# EAGLE design MODUL_GNU-BO_BRIDGE_V101 (EAGLE 6.4)
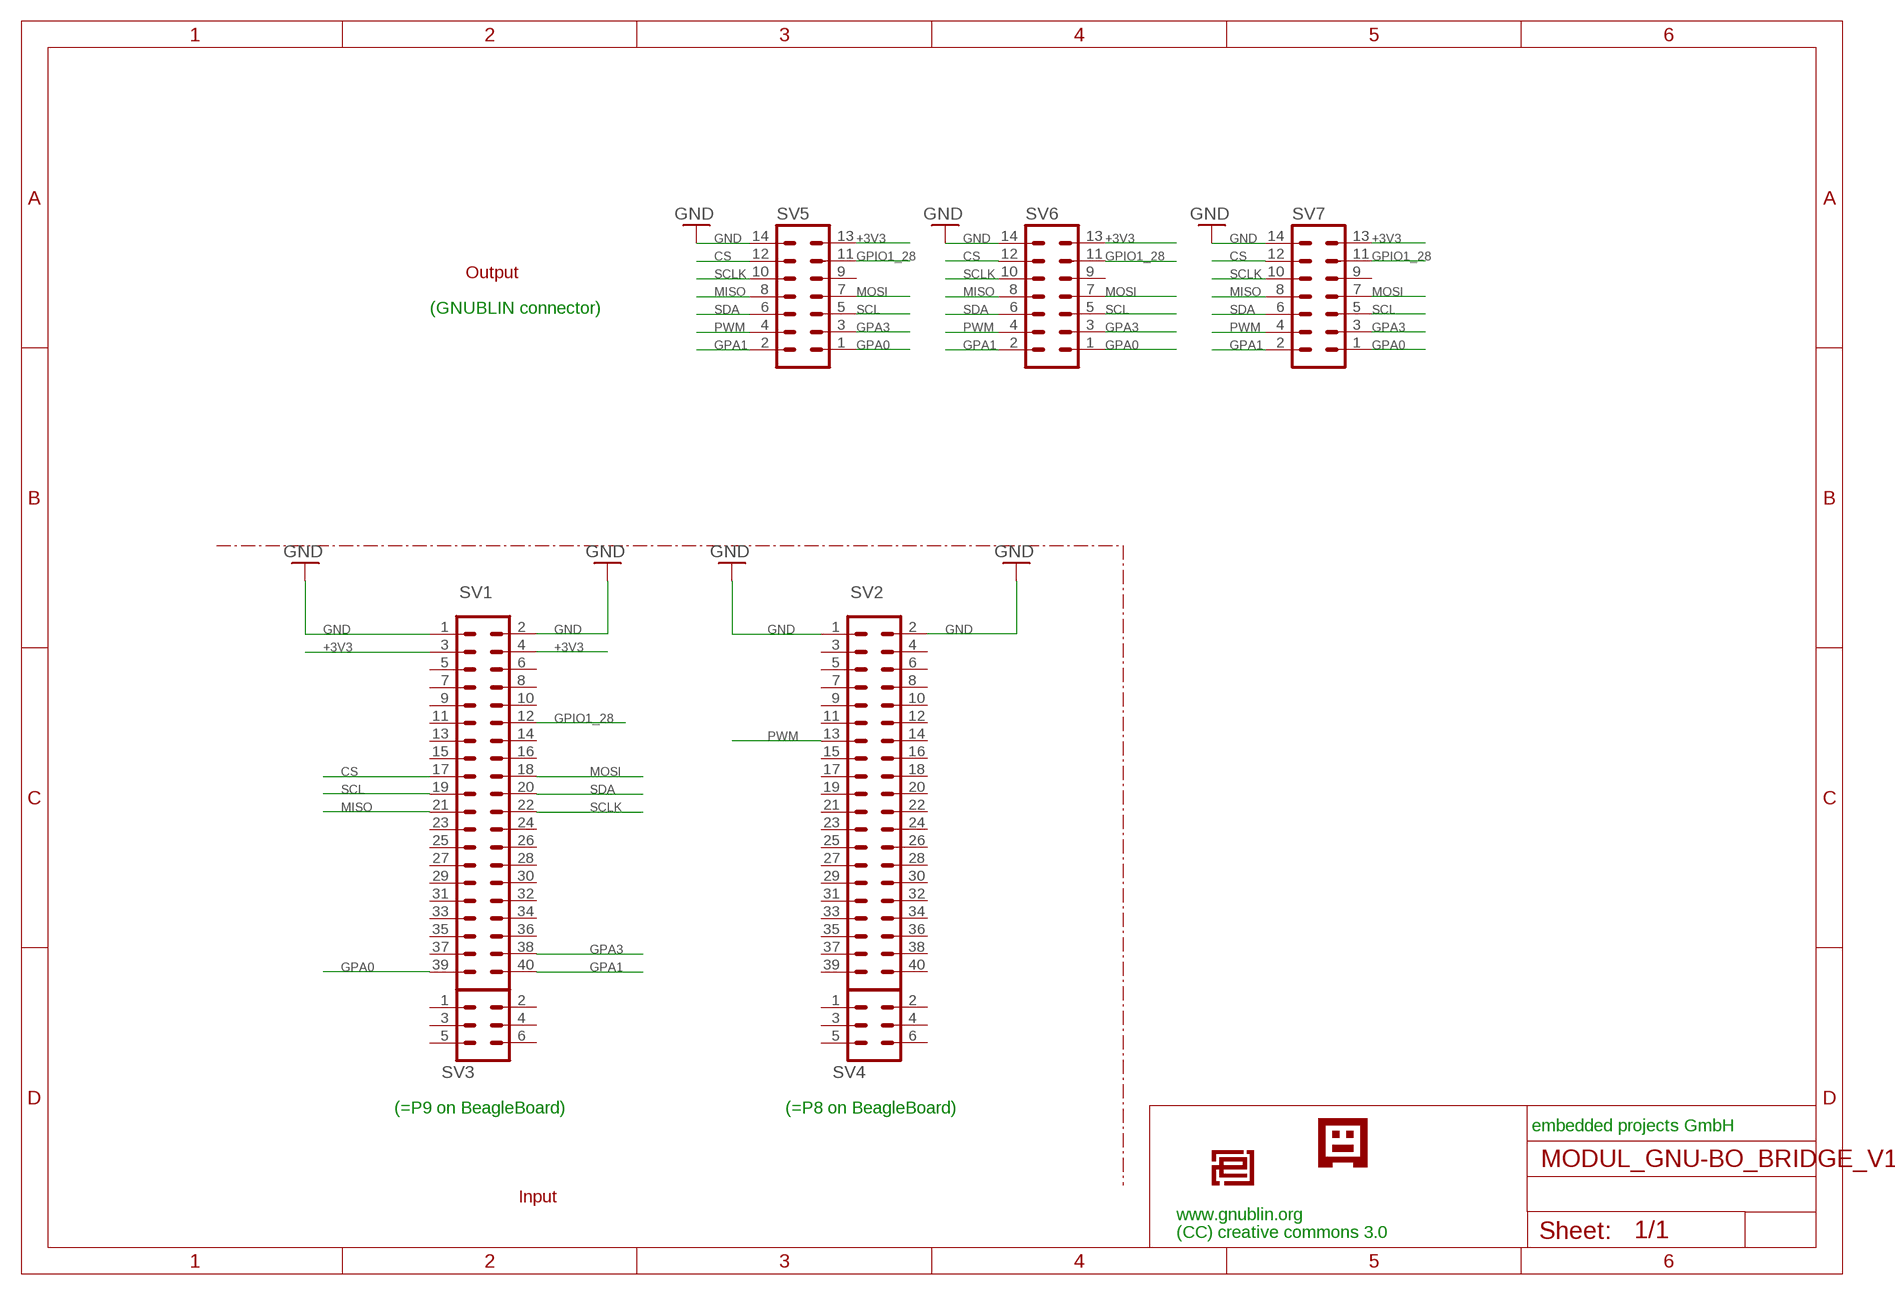
[diagram p0: schematic, sheet 1]

## Parts
SV1  MA20-2  [MA20-2]
SV2  MA20-2  [MA20-2]
SV3  MA03-2  [MA03-2]
SV4  MA03-2  [MA03-2]
SV5  ML14  [ML14]
SV6  ML14  [ML14]
SV7  ML14  [ML14]
U$2  EPLOGOSIEB  [EPLOGOSIEBDRUCK]
U$3  GNUBLINLOGOSIEB  [GNUSIEBDRUCK]

## Nets
+3V3: SV1.3 SV1.4 SV5.13 SV6.13 SV7.13
CS: SV1.17 SV5.12 SV6.12 SV7.12
GND: SV1.1 SV1.2 SV2.1 SV2.2 SV5.14 SV6.14 SV7.14
GPA0: SV1.39 SV5.1 SV6.1 SV7.1
GPA1: SV1.40 SV5.2 SV6.2 SV7.2
GPA3: SV1.38 SV5.3 SV6.3 SV7.3
GPIO1_28: SV1.12 SV5.11 SV6.11 SV7.11
MISO: SV1.21 SV5.8 SV6.8 SV7.8
MOSI: SV1.18 SV5.7 SV6.7 SV7.7
PWM: SV2.13 SV5.4 SV6.4 SV7.4
SCL: SV1.19 SV5.5 SV6.5 SV7.5
SCLK: SV1.22 SV5.10 SV6.10 SV7.10
SDA: SV1.20 SV5.6 SV6.6 SV7.6
Unconnected: SV1.5 SV1.6 SV1.7 SV1.8 SV1.9 SV1.10 SV1.11 SV1.13 SV1.14 SV1.15 SV1.16 SV1.23 SV1.24 SV1.25 SV1.26 SV1.27 SV1.28 SV1.29 SV1.30 SV1.31 SV1.32 SV1.33 SV1.34 SV1.35 SV1.36 SV1.37 SV2.3 SV2.4 SV2.5 SV2.6 SV2.7 SV2.8 SV2.9 SV2.10 SV2.11 SV2.12 SV2.14 SV2.15 SV2.16 SV2.17 SV2.18 SV2.19 SV2.20 SV2.21 SV2.22 SV2.23 SV2.24 SV2.25 SV2.26 SV2.27 SV2.28 SV2.29 SV2.30 SV2.31 SV2.32 SV2.33 SV2.34 SV2.35 SV2.36 SV2.37 SV2.38 SV2.39 SV2.40 SV3.1 SV3.2 SV3.3 SV3.4 SV3.5 SV3.6 SV4.1 SV4.2 SV4.3 SV4.4 SV4.5 SV4.6 SV5.9 SV6.9 SV7.9

## Notes on the sheet
- Output
- (GNUBLIN connector)
- (=P9 on BeagleBoard) | (=P8 on BeagleBoard)
- embedded projects GmbH
- Input
- www.gnublin.org
- (CC) creative commons 3.0

## Library data of the parts
SV1 SV2 = con-lstb:MA20-2: PIN HEADER
SV3 SV4 = con-lstb:MA03-2: PIN HEADER
SV5-SV7 = con-ml:ML14: HARTING
U$2 = EmbeddedProjectsLogos2:EPLOGO
U$3 = EmbeddedProjectsLogos2:GNUBLINLOGO

## Board
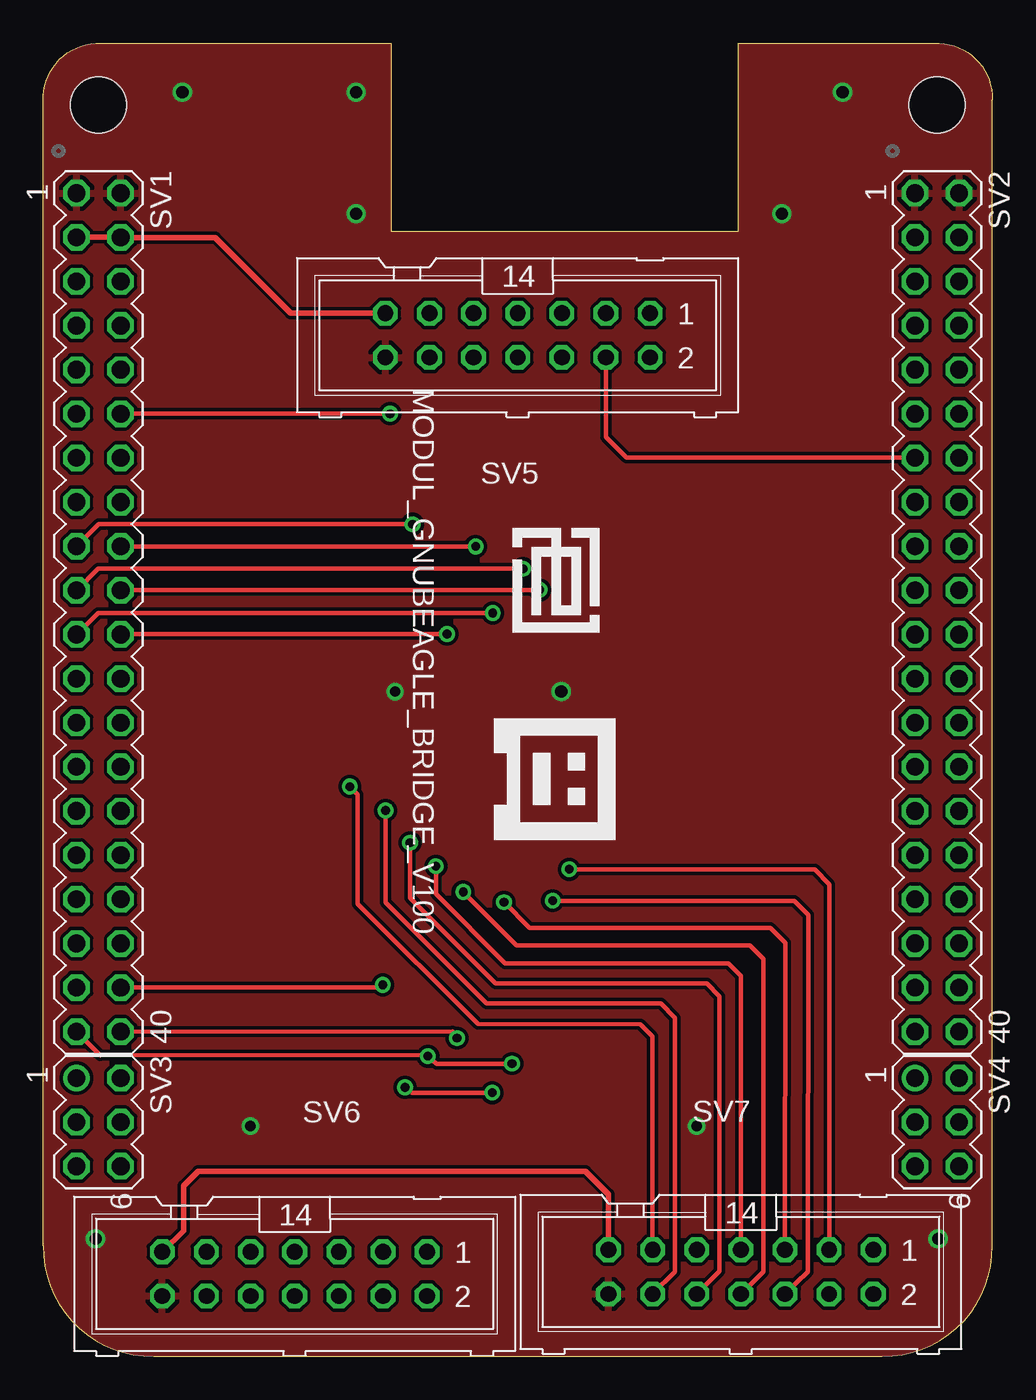
[diagram p1: board, top side]
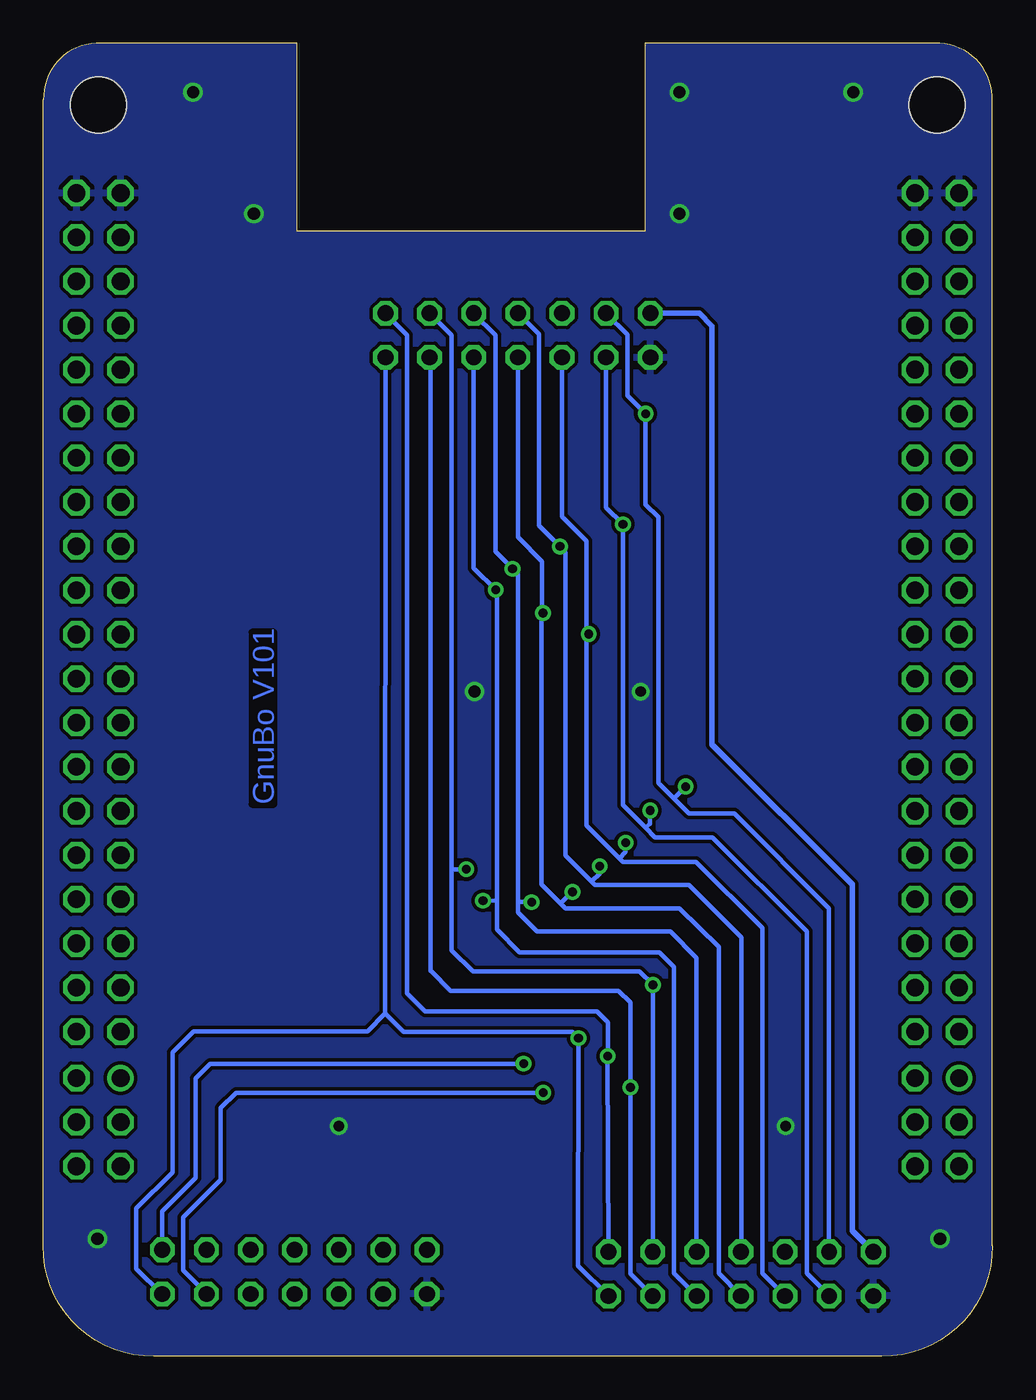
[diagram p2: board, bottom side, seen from below]

Size 54.61 x 75.55 mm. Coordinates in mm from the lower left corner, seen from the top.
Outline: 0,6.35 0,72.54 arc-90 3.3,75.55 20,75.55 20,64.75 40,64.75 40,75.55 51.56,75.55 arc-90 54.61,72.32 54.61,6.35 arc-92 48.26,0 6.35,0 arc-92 0,6.35
Copper layers (1*16): Top 0.035mm / dielectric 1.5mm / Bottom 0.035mm
Design rules "default *": minimum track width 8mil, minimum drill 15mil, track to track 8mil, track to pad 8mil, pad to pad 8mil, via to via 8mil, smd to smd 8mil, copper to edge 1mil, drill to drill 8mil, minimum pad ring 10mil, minimum via ring 8mil, stop-mask expansion 2mil, vias tented up to drill 40mil, thermal gap 10mil
Holes 3.2 mm at 51.44,72.01 3.17,72.01

### Footprints (pad centres in the part's own frame; a part is rotated, then mirrored left to right if it is on the bottom)
MA20-2 = drill 1.016 octagon: 1 -24.13,-1.27; 2 -24.13,1.27; 3 -21.59,-1.27; 4 -21.59,1.27; 5 -19.05,-1.27; 6 -19.05,1.27; 7 -16.51,-1.27; 8 -16.51,1.27; 9 -13.97,-1.27; 10 -13.97,1.27; 11 -11.43,-1.27; 12 -11.43,1.27; 13 -8.89,-1.27; 14 -8.89,1.27; 15 -6.35,-1.27; 16 -6.35,1.27; 17 -3.81,-1.27; 18 -3.81,1.27; 19 -1.27,-1.27; 20 -1.27,1.27; 21 1.27,-1.27; 22 1.27,1.27; 23 3.81,-1.27; 24 3.81,1.27; 25 6.35,-1.27; 26 6.35,1.27; 27 8.89,-1.27; 28 8.89,1.27; 29 11.43,-1.27; 30 11.43,1.27; 31 13.97,-1.27; 32 13.97,1.27; 33 16.51,-1.27; 34 16.51,1.27; 35 19.05,-1.27; 36 19.05,1.27; 37 21.59,-1.27; 38 21.59,1.27; 39 24.13,-1.27; 40 24.13,1.27
MA03-2 = drill 1.016: 1 -2.54,-1.27 | drill 1.016 octagon: 2 -2.54,1.27; 3 0,-1.27; 4 0,1.27; 5 2.54,-1.27; 6 2.54,1.27
ML14 = drill 0.914 octagon: 1 -7.62,-1.27; 2 -7.62,1.27; 3 -5.08,-1.27; 4 -5.08,1.27; 5 -2.54,-1.27; 6 -2.54,1.27; 7 0,-1.27; 8 0,1.27; 9 2.54,-1.27; 10 2.54,1.27; 11 5.08,-1.27; 12 5.08,1.27; 13 7.62,-1.27; 14 7.62,1.27

### Placement (x,y rotation side)
SV1  3.17,42.8 270 top
SV2  51.44,42.8 270 top
SV3  3.17,13.46 270 top
SV4  51.44,13.46 270 top
SV5  27.3,58.75 180 top
SV6  14.46,4.73 180 top
SV7  40.15,4.84 180 top
U$2  27,47.66 270 top
U$3  25.93,36.71 270 top

### Tracks (layer width: path | path; a pad name or v marks a point on that pad's centre or on a via)
+3V3
  Top 0.305: SV5.13 14.24,60.02 9.88,64.38 SV1.4 SV1.3 | SV7.13 32.53,9.3 31.19,10.64 8.9,10.64 8.06,9.8 8.06,7.21 SV6.13
  Bottom 0.305: SV6.13 8.06,7.21 8.06,27.14 16.12,35.2 16.12,59.28 16.86,60.02 SV5.13
CS  (via drill 0.5)
  Top 0.254: v21.25,47.88 3.17,47.88 SV1.17 | SV7.12 36.34,4.86 36.34,19.48 35.53,20.29 25.51,20.29 19.69,26.11 19.69,31.17 v19.69,31.4
  Bottom 0.254: SV5.12 22.22,48.85 v21.26,47.89 | v21.26,47.89 v21.25,47.88 | v21.26,47.89 21.25,31.71 19.96,30.41 | 19.96,30.41 19.4,29.84 16.09,29.85 10.66,24.45 10.66,4.76 SV6.12 | v19.69,31.4 19.69,30.64 19.96,30.41
GND  (via drill 0.6, 0.7)
  other vias: 3,6.75 8,72.75 18,72.75 46,72.75 42.5,65.75 18,65.75 51.5,6.75 11.9,13.25 37.6,13.25 29.8,38.25 20.24,38.25
  pour Top: -0.18,77.16 55.58,77.78 56.26,-1 -0.94,-1.1
  pour Bottom: -0.91,77.16 55.25,77.37 55.81,-0.8 -0.97,-0.92
GPA0  (via drill 0.5)
  Top 0.254: SV1.39 1.93,18.67 3.28,17.32 22.04,17.33 v22.13,17.26 22.64,16.83 v26.97,16.83
  Bottom 0.254: SV6.1 22.1,6.01 v22.13,17.26 22.11,17.37 22.11,19.21 22.74,19.84 32.65,19.84 33.68,20.87 33.68,58.76 34.92,60 SV5.1 | SV7.1 47.77,8.34 45.86,10.25 45.85,16 45,16.83 26.99,16.83 v26.97,16.83
GPA1  (via drill 0.5)
  Top 0.254: SV1.40 23.55,18.68 v23.81,18.3
  Bottom 0.254: SV6.2 23.83,5.2 v23.81,18.3 24.16,18.65 33.88,18.66 34.94,19.72 | SV5.2 34.94,19.72 | SV7.2 47.82,3.57 49.26,5.02 49.26,8.5 47.17,10.59 47.17,17.49 45.96,18.68 35.96,18.68 34.94,19.72
GPA3  (via drill 0.5)
  Top 0.254: SV1.38 19.37,21.21 v19.53,21.37 | v30.27,28.02 43.64,28.02 44.4,28.02 45.23,27.13 SV7.3
  Bottom 0.254: SV6.3 19.53,6.01 v19.53,21.37 v19.54,21.38 19.54,21.39 20.29,22.15 29.89,22.15 31.11,23.35 31.11,27.83 | SV5.3 31.12,58.76 31.11,28.02 | 31.11,28.02 31.11,27.83 | v30.27,28.02 31.11,28.02 | 31.11,28.02 31.11,27.83
GPIO1_28  (via drill 0.5)
  Top 0.254: v19.95,54.24 SV1.12 | SV7.11 35.07,18.4 34.37,19.1 25.02,19.11 18.08,26.03 18.08,32.33 v17.64,32.78
  Bottom 0.254: SV5.11 20.99,58.78 20.99,55.28 v19.95,54.24 19.95,49.01 19.22,48.28 19.22,32.99 18.32,32.09 | 18.32,32.09 17.45,31.22 14.85,31.22 9.39,25.76 SV6.11 | v17.64,32.78 18.32,32.09
MISO  (via drill 0.5)
  Top 0.254: v25.86,42.77 3.14,42.77 SV1.21 | SV7.8 40.18,3.57 41.44,4.84 41.44,22.86 40.66,23.64 27.24,23.64 v24.16,26.72
  Bottom 0.254: SV5.8 27.3,47.13 25.91,45.74 25.91,42.84 v25.86,42.77 25.88,42.72 25.95,42.63 25.95,27.16 24.86,26.06 | 24.86,26.06 24.56,25.77 17.99,25.77 15.73,23.56 15.73,4.77 SV6.8 | v24.16,26.72 24.2,26.72 24.86,26.06
MOSI  (via drill 0.5)
  Top 0.254: v24.88,46.6 4.48,46.6 SV1.18 | SV7.7 40.15,21.88 39.43,22.6 26.58,22.6 22.59,26.61 v22.59,28.2
  Bottom 0.254: SV5.7 26.08,58.81 26.08,47.81 v24.88,46.6 24.88,46.58 24.56,46.26 24.56,28.81 23.06,27.31 | 23.06,27.31 22.86,27.11 17.46,27.11 14.44,24.09 14.44,6.02 SV6.7 | v22.59,28.2 22.59,27.77 23.06,27.31
PWM  (via drill 0.5)
  Top 0.254: SV5.4 32.38,52.9 33.57,51.71 50.15,51.71 SV2.13 | v25.84,15.16 21.21,15.15 v20.82,15.47
  Bottom 0.254: SV7.4 45.23,3.59 46.58,4.95 46.58,7.99 44.41,10.16 44.41,14.3 43.52,15.16 26.13,15.16 v25.84,15.16 | SV6.4 20.82,4.74 v20.82,15.47 20.82,20.36 21.5,21.02 31.19,21.02 32.31,22.16 32.33,22.17 32.34,57.44 SV5.4
SCL  (via drill 0.5)
  Top 0.254: v27.61,45.32 3.15,45.32 SV1.19 | SV7.5 42.67,6.13 42.71,23.78 41.84,24.65 38.37,24.65 28.25,24.65 27.99,24.65 v26.51,26.13
  Bottom 0.254: SV5.5 28.59,58.76 28.59,46.3 v27.61,45.32 27.3,45.01 27.3,26.14 | 27.3,26.14 27.3,25.55 26.19,24.44 25.69,24.44 18.53,24.44 17.01,22.92 SV6.5 | v26.51,26.13 27.29,26.13 27.3,26.14
SCLK  (via drill 0.5)
  Top 0.254: v23.23,41.56 4.47,41.56 SV1.22 | SV7.10 37.63,3.57 38.92,4.87 38.92,20.7 38.18,21.44 26.02,21.44 21.09,26.36 v21.1,29.55
  Bottom 0.254: SV5.10 24.76,48.32 23.36,46.92 23.36,41.71 v23.23,41.56 23.26,41.56 23.36,41.46 23.36,30.55 21.44,28.63 | 21.44,28.63 21.24,28.43 17.04,28.43 13.23,24.65 13.23,4.76 SV6.10 | v21.1,29.55 21.1,29.01 21.44,28.63
SDA  (via drill 0.5)
  Top 0.254: v28.57,44.1 4.47,44.1 SV1.20 | v29.31,26.21 29.79,26.2 43.21,26.2 43.22,26.2 44.03,25.39 43.99,4.85 SV7.6
  Bottom 0.254: SV5.6 29.84,45.37 v28.57,44.1 28.5,44.03 28.51,26.22 | SV6.6 18.32,4.77 18.32,22.4 19.16,23.24 27.2,23.24 28.5,24.57 | 28.5,24.57 28.5,24.95 28.51,26.22 | SV7.6 42.73,3.57 | v29.31,26.21 28.51,26.22 | 28.51,26.22 28.5,24.57

### Text on the board
Bottom: GnuBo V101
tNames: MODUL_GNUBEAGLE_BRIDGE_V100
tDocu: www.gnublin.org | Module-GnuBo | +3V3,IO1.28,---,MOSI,SCL,GPA3,GPA0 | GND,CS,SCLK,MISO,SDA,PWM,GPA1 | +3V3,IO1.28,-,MOSI,SCL,GPA3,GPA0 | +3V3,IO1.28,-,MOSI,SCL,GPA3,GPA0 | GND,CS,SCLK,MISO,SDA,PWM,GPA1 | GND,CS,SCLK,MISO,SDA,PWM,GPA1